# Altium schematic sheet AUAV_X05_UWB.SchDoc
size 209 x 148 mm
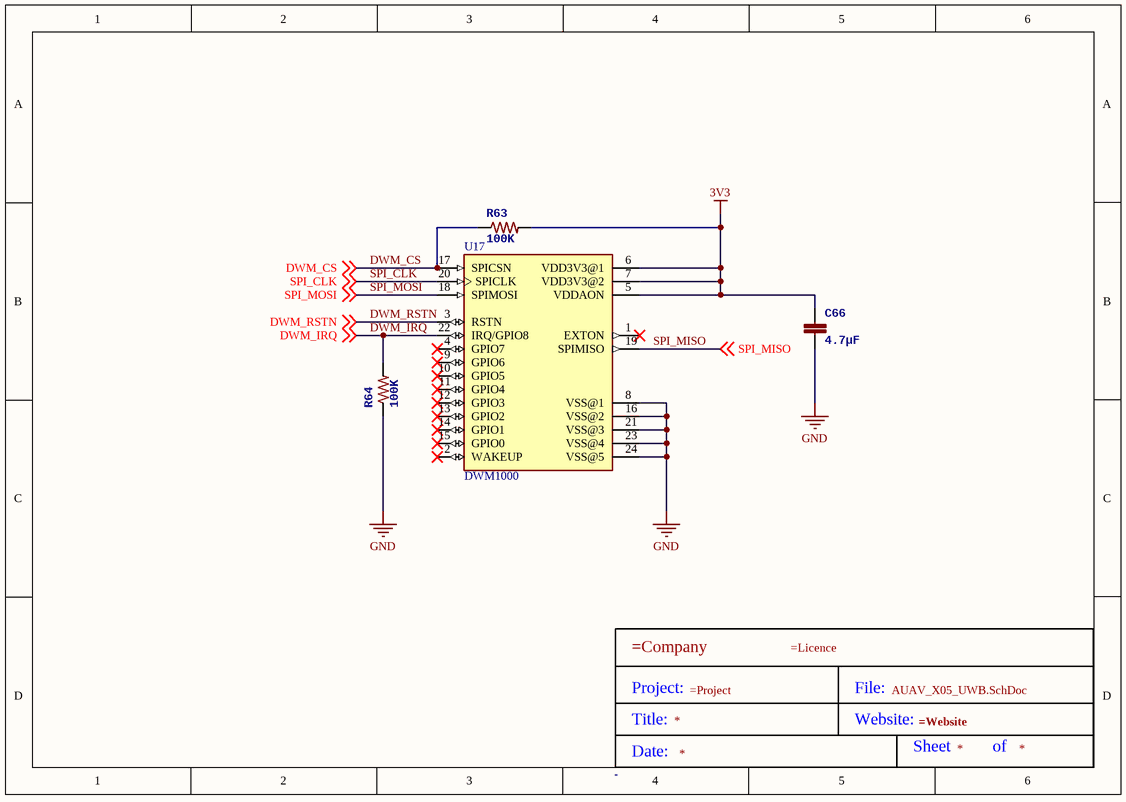
[diagram p0: AUAV_X05_UWB.SchDoc]

## Parts
*?  Title Block  (value not drawn)
C66  4.7µF  [0603-CAP]
R63  100K  [0402-RES]
R64  100K  [0402-RES]
U17  DWM1000  [XCVR_DWM1000]

## Nets
3V3: C66.P$1 R63.P$2 U17.5(VDDAON) U17.6(VDD3V3@1) U17.7(VDD3V3@2)
GND: C66.P$2 R64.P$1 U17.8(VSS@1) U17.16(VSS@2) U17.21(VSS@3) U17.23(VSS@4) U17.24(VSS@5)
DWM_CS: R63.P$1 U17.17(SPICSN) ; off-sheet DWM_CS
DWM_IRQ: R64.P$2 U17.22(IRQ/GPIO8) ; off-sheet DWM_IRQ
DWM_RSTN: U17.3(RSTN) ; off-sheet DWM_RSTN
SPI_CLK: U17.20(SPICLK) ; off-sheet SPI_CLK
SPI_MISO: U17.19(SPIMISO) ; off-sheet SPI_MISO
SPI_MOSI: U17.18(SPIMOSI) ; off-sheet SPI_MOSI

Not connected (* = marked no-connect by the designer): U17 1(EXTON)* 2(WAKEUP)* 4(GPIO7)* 9(GPIO6)* 10(GPIO5)* 11(GPIO4)* 12(GPIO3)* 13(GPIO2)* 14(GPIO1)* 15(GPIO0)*

## Notes on the sheet
- (in symbol Title Block) Project:; File:; Title:; Website:; Sheet; of; Date:

## Library data of the parts
C66 = CAP0603: CAP CER 2.2UF 16V 10% X6S 0603; PARTNO: C1608X6S1C225K080AC; 3DR_PARTNO: ECM0619; Value: 2u2; Supplier 1: Digi-Key; Supplier Part Number 1: 445-7438-1-ND
R63 R64 = RESISTOR0402-RES: RES 10K OHM 1/16W 1% 0402 SMD; PARTNO: RC0402FR-0710KL; 3DR_PARTNO: ECM0800; Supplier 1: Digi-Key; Value: 10K; Supplier Part Number 1: 311-10.0KLRCT-ND
U17 = DWM1000: 802.15.4 IR-UWB Transceiver Module 3.5GHz ~ 6.5GHz Integrated, Chip Surface Mount; MF: Decawave Limited; Package: Module Decawave; Availability: Unavailable; Value: *; MP: DWM1000; SnapEDA_Link: https://www.snapeda.com/parts/DWM1000/Decawave%20Limited/view-part/327593/?ref=snap; Price: None
*? = Title Block: Size: -